# Altium schematic sheet SY_HR08_MCU_CTL_V1.1.SchDoc
size A3; PageSetup: Record=PageOptions|CenterHorizontal=True|CenterVertical=True|PrintScale=0.71|XCorrection=1.00|YCorrection=1.00|PrintKind=2|BorderSize=5000000|LeftOffset=0|BottomOffset=0|Orientation=2|PaperLength=1000|PaperWidth=1000|Scale=100|PaperSource=7|PrintQuality=-3|MediaType=1|DitherType=10|PrintScaleMode=1|PaperKind=A4|PaperIndex=9
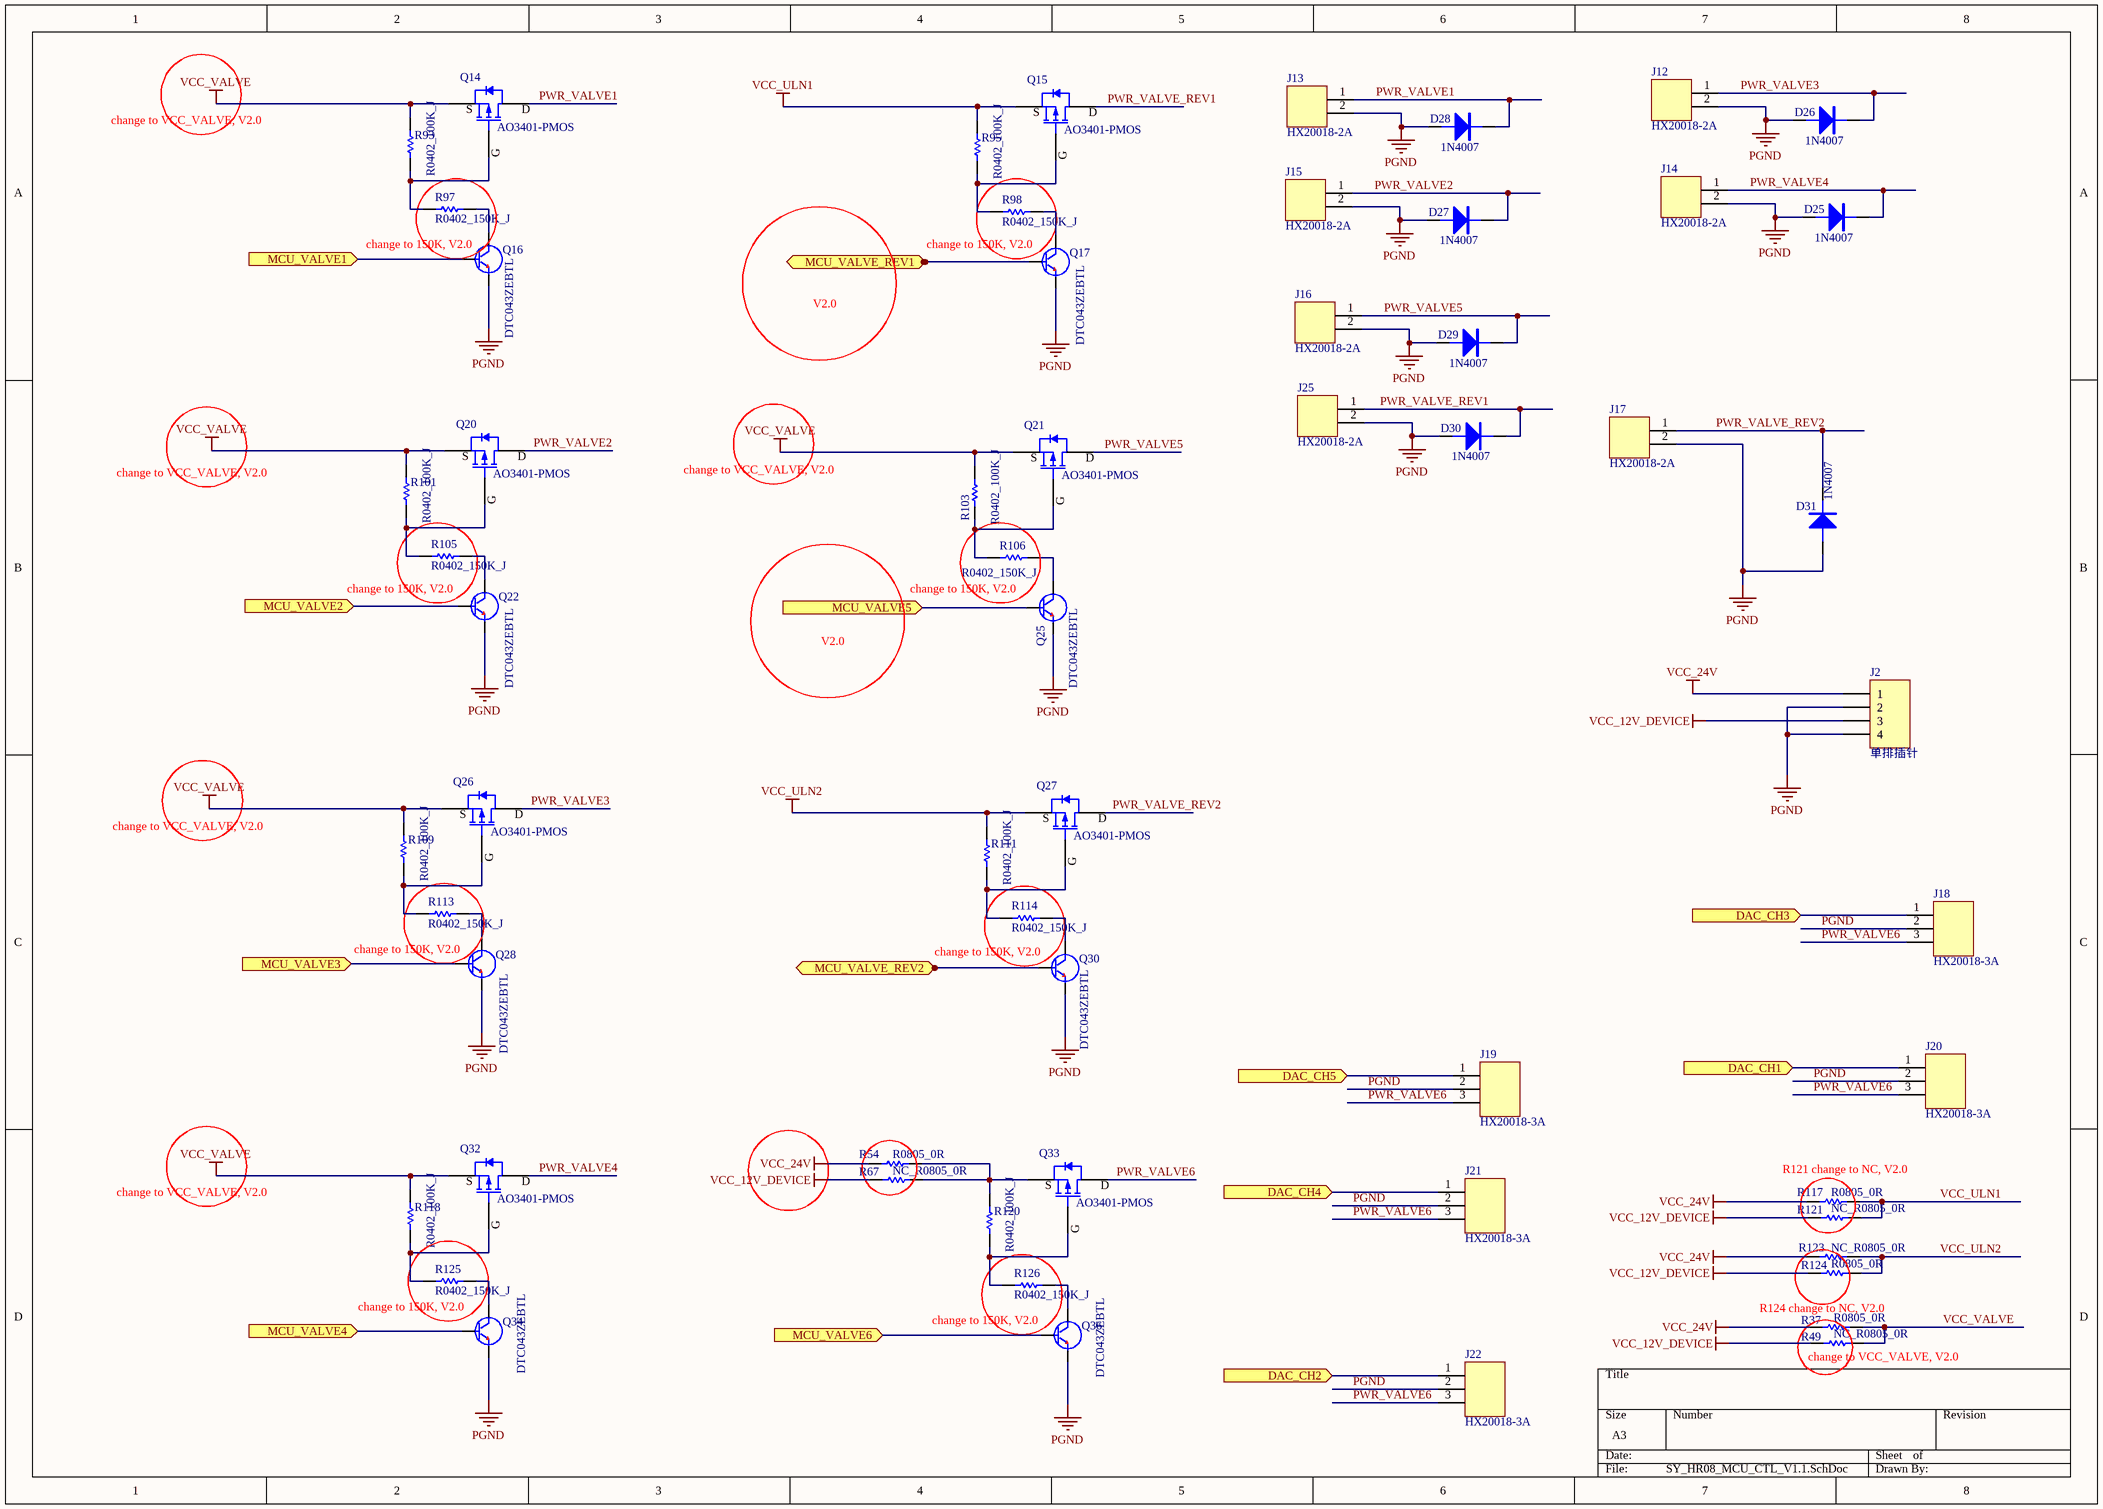
[diagram p0: SY_HR08_MCU_CTL_V1.1.SchDoc]

## Parts
D25  1N4007  [1N4007]
D26  1N4007  [1N4007]
D27  1N4007  [1N4007]
D28  1N4007  [1N4007]
D29  1N4007  [1N4007]
D30  1N4007  [1N4007]
D31  1N4007  [1N4007]
J2  单排插针  [CON1X4(2.54mm)]
J12  HX20018-2A  [HX20018-2A]
J13  HX20018-2A  [HX20018-2A]
J14  HX20018-2A  [HX20018-2A]
J15  HX20018-2A  [HX20018-2A]
J16  HX20018-2A  [HX20018-2A]
J17  HX20018-2A  [HX20018-2A]
J18  HX20018-3A  [HX20018-3A]
J19  HX20018-3A  [HX20018-3A]
J20  HX20018-3A  [HX20018-3A]
J21  HX20018-3A  [HX20018-3A]
J22  HX20018-3A  [HX20018-3A]
J25  HX20018-2A  [HX20018-2A]
Q14  AO3401-PMOS  [AO3400]
Q15  AO3401-PMOS  [AO3400]
Q16  DTC043ZEBTL  [DTC043ZEBTL$2F$$2F$DTC143ZE$2F$$2F$LDTC143ZET1G]
Q17  DTC043ZEBTL  [DTC043ZEBTL$2F$$2F$DTC143ZE$2F$$2F$LDTC143ZET1G]
Q20  AO3401-PMOS  [AO3400]
Q21  AO3401-PMOS  [AO3400]
Q22  DTC043ZEBTL  [DTC043ZEBTL$2F$$2F$DTC143ZE$2F$$2F$LDTC143ZET1G]
Q25  DTC043ZEBTL  [DTC043ZEBTL$2F$$2F$DTC143ZE$2F$$2F$LDTC143ZET1G]
Q26  AO3401-PMOS  [AO3400]
Q27  AO3401-PMOS  [AO3400]
Q28  DTC043ZEBTL  [DTC043ZEBTL$2F$$2F$DTC143ZE$2F$$2F$LDTC143ZET1G]
Q30  DTC043ZEBTL  [DTC043ZEBTL$2F$$2F$DTC143ZE$2F$$2F$LDTC143ZET1G]
Q32  AO3401-PMOS  [AO3400]
Q33  AO3401-PMOS  [AO3400]
Q34  DTC043ZEBTL  [DTC043ZEBTL$2F$$2F$DTC143ZE$2F$$2F$LDTC143ZET1G]
Q36  DTC043ZEBTL  [DTC043ZEBTL$2F$$2F$DTC143ZE$2F$$2F$LDTC143ZET1G]
R37  R0805_0R  [RES0805]
R49  NC_R0805_0R  [RES0805]
R54  R0805_0R  [RES0805]
R67  NC_R0805_0R  [RES0805]
R93  R0402_100K_J  [RES0402_HQ]
R95  R0402_100K_J  [RES0402_HQ]
R97  R0402_150K_J  [RES0402_HQ]
R98  R0402_150K_J  [RES0402_HQ]
R101  R0402_100K_J  [RES0402_HQ]
R103  R0402_100K_J  [RES0402_HQ]
R105  R0402_150K_J  [RES0402_HQ]
R106  R0402_150K_J  [RES0402_HQ]
R109  R0402_100K_J  [RES0402_HQ]
R111  R0402_100K_J  [RES0402_HQ]
R113  R0402_150K_J  [RES0402_HQ]
R114  R0402_150K_J  [RES0402_HQ]
R117  R0805_0R  [RES0805]
R118  R0402_100K_J  [RES0402_HQ]
R120  R0402_100K_J  [RES0402_HQ]
R121  NC_R0805_0R  [RES0805]
R123  NC_R0805_0R  [RES0805]
R124  R0805_0R  [RES0805]
R125  R0402_150K_J  [RES0402_HQ]
R126  R0402_150K_J  [RES0402_HQ]

## Ports
DAC_CH1 (in), DAC_CH2 (in), DAC_CH3 (in), DAC_CH4 (in), DAC_CH5 (in), MCU_VALVE1 (in), MCU_VALVE2 (in), MCU_VALVE3 (in), MCU_VALVE4 (in), MCU_VALVE5 (in), MCU_VALVE6 (in), MCU_VALVE_REV1 (in), MCU_VALVE_REV2 (in)

## Nets
PGND: D25.2 D26.2 D27.2 D28.2 D29.2 D30.2 D31.2 J2.2 J2.4 J12.2 J13.2 J14.2 J15.2 J16.2 J17.2 J18.2 J19.2 J20.2 J21.2 J22.2 J25.2 Q16.2(E) Q17.2(E) Q22.2(E) Q25.2(E) Q28.2(E) Q30.2(E) Q34.2(E) Q36.2(E)
VCC_12V_DEVICE: J2.3 R49.1 R67.1 R121.1 R124.1
VCC_24V: J2.1 R37.1 R54.1 R117.1 R123.1
VCC_ULN1: Q15.2(S) R95.2 R117.2 R121.2
VCC_ULN2: Q27.2(S) R111.2 R123.2 R124.2
VCC_VALVE: Q14.2(S) Q20.2(S) Q21.2(S) Q26.2(S) Q32.2(S) R37.2 R49.2 R93.2 R101.2 R103.2 R109.2 R118.2
DAC_CH1: J20.1 ; port DAC_CH1
DAC_CH2: J22.1 ; port DAC_CH2
DAC_CH3: J18.1 ; port DAC_CH3
DAC_CH4: J21.1 ; port DAC_CH4
DAC_CH5: J19.1 ; port DAC_CH5
MCU_VALVE1: Q16.1(B) ; port MCU_VALVE1
MCU_VALVE2: Q22.1(B) ; port MCU_VALVE2
MCU_VALVE3: Q28.1(B) ; port MCU_VALVE3
MCU_VALVE4: Q34.1(B) ; port MCU_VALVE4
MCU_VALVE5: Q25.1(B) ; port MCU_VALVE5
MCU_VALVE6: Q36.1(B) ; port MCU_VALVE6
MCU_VALVE_REV1: Q17.1(B) ; port MCU_VALVE_REV1
MCU_VALVE_REV2: Q30.1(B) ; port MCU_VALVE_REV2
PWR_VALVE1: D28.1 J13.1 Q14.3(D)
PWR_VALVE2: D27.1 J15.1 Q20.3(D)
PWR_VALVE3: D26.1 J12.1 Q26.3(D)
PWR_VALVE4: D25.1 J14.1 Q32.3(D)
PWR_VALVE5: D29.1 J16.1 Q21.3(D)
PWR_VALVE6: J18.3 J19.3 J20.3 J21.3 J22.3 Q33.3(D)
PWR_VALVE_REV1: D30.1 J25.1 Q15.3(D)
PWR_VALVE_REV2: D31.1 J17.1 Q27.3(D)
NetQ14_1: Q14.1(G) R93.1 R97.2
NetQ15_1: Q15.1(G) R95.1 R98.2
NetQ16_3: Q16.3(C) R97.1
NetQ17_3: Q17.3(C) R98.1
NetQ20_1: Q20.1(G) R101.1 R105.2
NetQ21_1: Q21.1(G) R103.1 R106.2
NetQ22_3: Q22.3(C) R105.1
NetQ25_3: Q25.3(C) R106.1
NetQ26_1: Q26.1(G) R109.1 R113.2
NetQ27_1: Q27.1(G) R111.1 R114.2
NetQ28_3: Q28.3(C) R113.1
NetQ30_3: Q30.3(C) R114.1
NetQ32_1: Q32.1(G) R118.1 R125.2
NetQ33_1: Q33.1(G) R120.1 R126.2
NetQ33_2: Q33.2(S) R54.2 R67.2 R120.2
NetQ34_3: Q34.3(C) R125.1
NetQ36_3: Q36.3(C) R126.1

## Notes on the sheet
- change to VCC_VALVE, V2.0
- (near Q16) change to 150K, V2.0
- (near Q17) change to 150K, V2.0
- V2.0
- (near Q22) change to 150K, V2.0
- (near Q25) change to 150K, V2.0
- (near Q28) change to 150K, V2.0
- (near Q30) change to 150K, V2.0
- R121 change to NC, V2.0
- (near Q34) change to 150K, V2.0
- (near Q36) change to 150K, V2.0
- (near R37) R124 change to NC, V2.0
- (near R49) change to VCC_VALVE, V2.0

## Library data of the parts
D25-D31 = 1N4007: 1N4007 整流二极管 1A 1000V
J2 = Header 4: Header, 4-Pin; LatestRevisionDate: 17-Jul-2002; LatestRevisionNote: Re-released for DXP Platform.; Publisher: Altium Limited
J12-J17 J25 = HX20018-2A: HX20018-2A  2.0mm; Geometry.Height: 8mm
J18-J22 = HX20018-3A: HX20018-3A  2.0mm
Q16 Q17 Q22 Q25 Q28 Q30 Q34 Q36 = DTC043ZEBTL: NPN三极管_100mA_EMT3F
R37 R49 R54 R67 R117 R121 R123 R124 = R0805_0R: 电阻0R(0805-0.125W-J); Value: 0R
R93 R95 R97 R98 R101 R103 R105 R106 R109 R111 R113 R114 R118 R120 R125 R126 = R0402_100K_J: 电阻100K(0402-0.0625W-J)